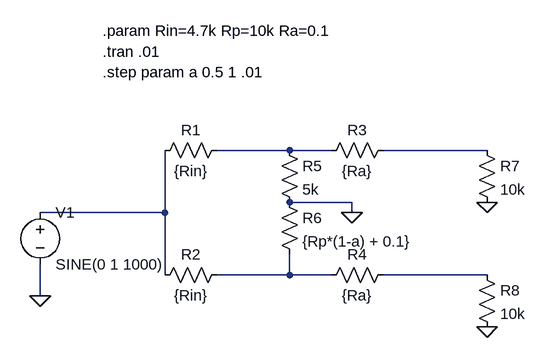
[diagram p0: schematic kino-pan.asc]
kino-pan.asc, the LTspice schematic file:
Version 4
SHEET 1 880 680
WIRE 320 96 208 96
WIRE 384 96 320 96
WIRE 624 96 464 96
WIRE 416 176 320 176
WIRE 128 192 128 96
WIRE 128 192 -64 192
WIRE 416 192 416 176
WIRE 128 288 128 192
WIRE 320 288 320 256
WIRE 320 288 208 288
WIRE 384 288 320 288
WIRE 624 288 464 288
WIRE -64 320 -64 272
FLAG 416 192 0
FLAG 624 176 0
FLAG 624 368 0
FLAG -64 320 0
SYMBOL res 224 80 R90
WINDOW 0 0 56 VBottom 2
WINDOW 3 32 56 VTop 2
SYMATTR InstName R1
SYMATTR Value {Rin}
SYMBOL res 224 272 R90
WINDOW 0 0 56 VBottom 2
WINDOW 3 32 56 VTop 2
SYMATTR InstName R2
SYMATTR Value {Rin}
SYMBOL res 480 80 R90
WINDOW 0 0 56 VBottom 2
WINDOW 3 32 56 VTop 2
SYMATTR InstName R3
SYMATTR Value {Ra}
SYMBOL res 480 272 R90
WINDOW 0 0 56 VBottom 2
WINDOW 3 32 56 VTop 2
SYMATTR InstName R4
SYMATTR Value {Ra}
SYMBOL res 304 80 R0
SYMATTR InstName R5
SYMATTR Value 5k
SYMBOL res 304 160 R0
SYMATTR InstName R6
SYMATTR Value {Rp*(1-a) + 0.1}
SYMBOL res 608 80 R0
SYMATTR InstName R7
SYMATTR Value 10k
SYMBOL res 608 272 R0
SYMATTR InstName R8
SYMATTR Value 10k
SYMBOL voltage -64 176 R0
WINDOW 123 0 0 Left 0
WINDOW 39 0 0 Left 0
SYMATTR InstName V1
SYMATTR Value SINE(0 1 1000)
TEXT 32 -88 Left 2 !.param Rin=4.7k Rp=10k Ra=0.1
TEXT 32 -56 Left 2 !.tran .01\n.step param a 0.5 1 .01

The netlist it stands for:
* kino-pan.asc
R1 N001 N003 {Rin}
R2 N004 N003 {Rin}
R3 N002 N001 {Ra}
R4 N005 N004 {Ra}
R5 N001 0 5k
R6 0 N004 {Rp*(1-a) + 0.1}
R7 N002 0 10k
R8 N005 0 10k
V1 N003 0 SINE(0 1 1000)
.param Rin=4.7k Rp=10k Ra=0.1
.tran .01
.step param a 0.5 1 .01
.backanno
.end